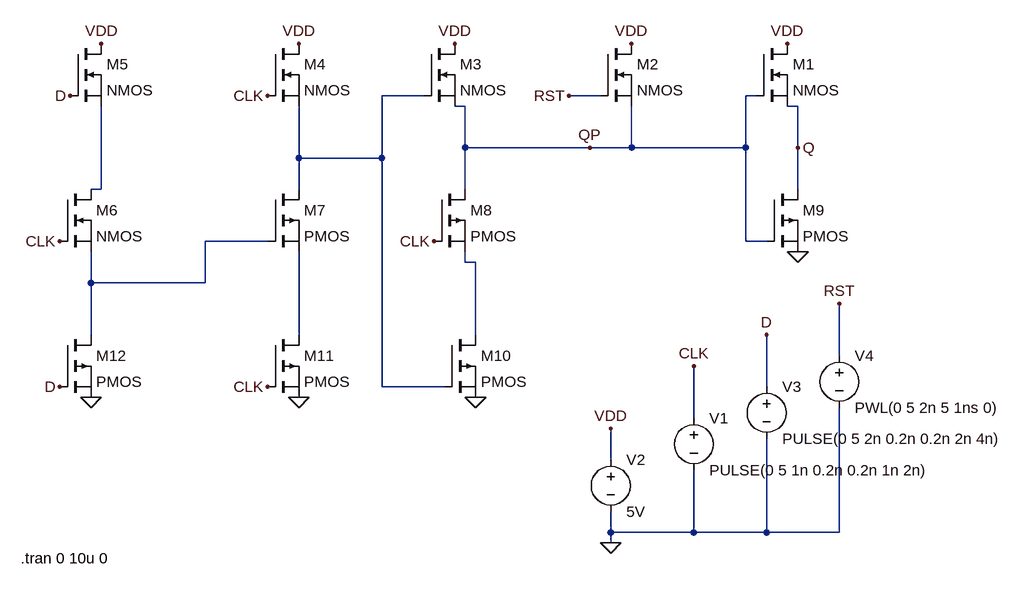
[diagram p0: schematic Draft1.asc]
Draft1.asc, the LTspice schematic file:
Version 4
SHEET 1 948 680
WIRE -992 -464 -1056 -464
WIRE -720 -464 -768 -464
WIRE -480 -464 -496 -464
WIRE -928 -448 -944 -448
WIRE -416 -448 -432 -448
WIRE -928 -384 -928 -448
WIRE -736 -384 -928 -384
WIRE -672 -384 -672 -448
WIRE -672 -384 -736 -384
WIRE -496 -384 -496 -464
WIRE -496 -384 -672 -384
WIRE -416 -384 -416 -448
WIRE -1184 -368 -1184 -448
WIRE -1056 -368 -1056 -464
WIRE -1056 -368 -1184 -368
WIRE -1488 -320 -1488 -448
WIRE -1488 -320 -1504 -320
WIRE -1184 -320 -1184 -368
WIRE -928 -320 -928 -384
WIRE -416 -320 -416 -384
WIRE -1232 -240 -1328 -240
WIRE -496 -240 -496 -384
WIRE -464 -240 -496 -240
WIRE -928 -208 -928 -224
WIRE -912 -208 -928 -208
WIRE -1504 -176 -1504 -224
WIRE -1328 -176 -1328 -240
WIRE -1328 -176 -1504 -176
WIRE -1504 -96 -1504 -176
WIRE -1184 -96 -1184 -224
WIRE -912 -96 -912 -208
WIRE -352 -64 -352 -144
WIRE -1056 -16 -1056 -368
WIRE -960 -16 -1056 -16
WIRE -464 -16 -464 -96
WIRE -576 32 -576 -48
WIRE -704 96 -704 48
WIRE -704 208 -704 176
WIRE -576 208 -576 112
WIRE -576 208 -704 208
WIRE -464 208 -464 64
WIRE -464 208 -576 208
WIRE -352 208 -352 16
WIRE -352 208 -464 208
WIRE -704 224 -704 208
FLAG -1536 -464 D
FLAG -1552 -240 CLK
FLAG -1232 -464 CLK
FLAG -768 -464 RST
FLAG -736 -384 QP
FLAG -704 48 VDD
FLAG -704 224 0
FLAG -576 -48 CLK
FLAG -464 -96 D
FLAG -352 -144 RST
FLAG -1488 -544 VDD
FLAG -1184 -544 VDD
FLAG -944 -544 VDD
FLAG -672 -544 VDD
FLAG -432 -544 VDD
FLAG -416 -384 Q
FLAG -912 0 0
FLAG -1184 0 0
FLAG -1504 0 0
FLAG -1552 -16 D
FLAG -1232 -16 CLK
FLAG -976 -240 CLK
FLAG -416 -224 0
SYMBOL voltage -576 16 R0
WINDOW 123 0 0 Left 0
WINDOW 39 0 0 Left 0
SYMATTR InstName V1
SYMATTR Value PULSE(0 5 1n 0.2n 0.2n 1n 2n)
SYMBOL voltage -704 80 R0
WINDOW 123 0 0 Left 0
WINDOW 39 0 0 Left 0
SYMATTR InstName V2
SYMATTR Value 5V
SYMBOL voltage -464 -32 R0
WINDOW 123 0 0 Left 0
WINDOW 39 0 0 Left 0
SYMATTR InstName V3
SYMATTR Value PULSE(0 5 2n 0.2n 0.2n 2n 4n)
SYMBOL voltage -352 -80 R0
WINDOW 123 0 0 Left 0
WINDOW 39 0 0 Left 0
SYMATTR InstName V4
SYMATTR Value PWL(0 5 2n 5 1ns 0)
SYMBOL nmos -480 -544 R0
SYMATTR InstName M1
SYMBOL nmos -720 -544 R0
SYMATTR InstName M2
SYMBOL nmos -992 -544 R0
SYMATTR InstName M3
SYMBOL nmos -1232 -544 R0
SYMATTR InstName M4
SYMBOL nmos -1536 -544 R0
SYMATTR InstName M5
SYMBOL nmos -1552 -320 R0
SYMATTR InstName M6
SYMBOL pmos -1232 -320 R0
SYMATTR InstName M7
SYMBOL pmos -976 -320 R0
SYMATTR InstName M8
SYMBOL pmos -464 -320 R0
SYMATTR InstName M9
SYMBOL pmos -960 -96 R0
SYMATTR InstName M10
SYMBOL pmos -1232 -96 R0
SYMATTR InstName M11
SYMBOL pmos -1552 -96 R0
SYMATTR InstName M12
TEXT -1612 248 Left 2 !.tran 0 10u 0

The netlist it stands for:
* Draft1.asc
V1 CLK 0 PULSE(0 5 1n 0.2n 0.2n 1n 2n)
V2 VDD 0 5V
V3 D 0 PULSE(0 5 2n 0.2n 0.2n 2n 4n)
V4 RST 0 PWL(0 5 2n 5 1ns 0)
M1 VDD QP Q Q NMOS
M2 VDD RST QP QP NMOS
M3 VDD N001 QP QP NMOS
M4 VDD CLK N001 N001 NMOS
M5 VDD D N002 N002 NMOS
M6 N002 CLK N003 N003 NMOS
M7 N001 N003 N005 N005 PMOS
M8 QP CLK N004 N004 PMOS
M9 Q QP 0 0 PMOS
M10 N004 N001 0 0 PMOS
M11 N005 CLK 0 0 PMOS
M12 N003 D 0 0 PMOS
.model NMOS NMOS
.model PMOS PMOS
.lib standard.mos
.tran 0 10u 0
.backanno
.end